# Altium schematic sheet mdv_commutator_v2.SchDoc
size 410 x 297 mm; DocumentNumber: 2; SheetNumber: 2; SheetTotal: 2; PageSetup: Record=PageOptions|CenterHorizontal=True|CenterVertical=True|PrintScale=1.00|XCorrection=1.00|YCorrection=1.00|PrintKind=1|BorderSize=5000000|LeftOffset=0|BottomOffset=0|Orientation=2|PaperLength=1000|PaperWidth=1000|Scale=100|PaperSource=15|PrintQuality=1200|MediaType=1|DitherType=10|PaperKind=A3|PrintScaleMode=1; Weight: -; ScaleFactor: -; NormInspection: Норм.Контр.
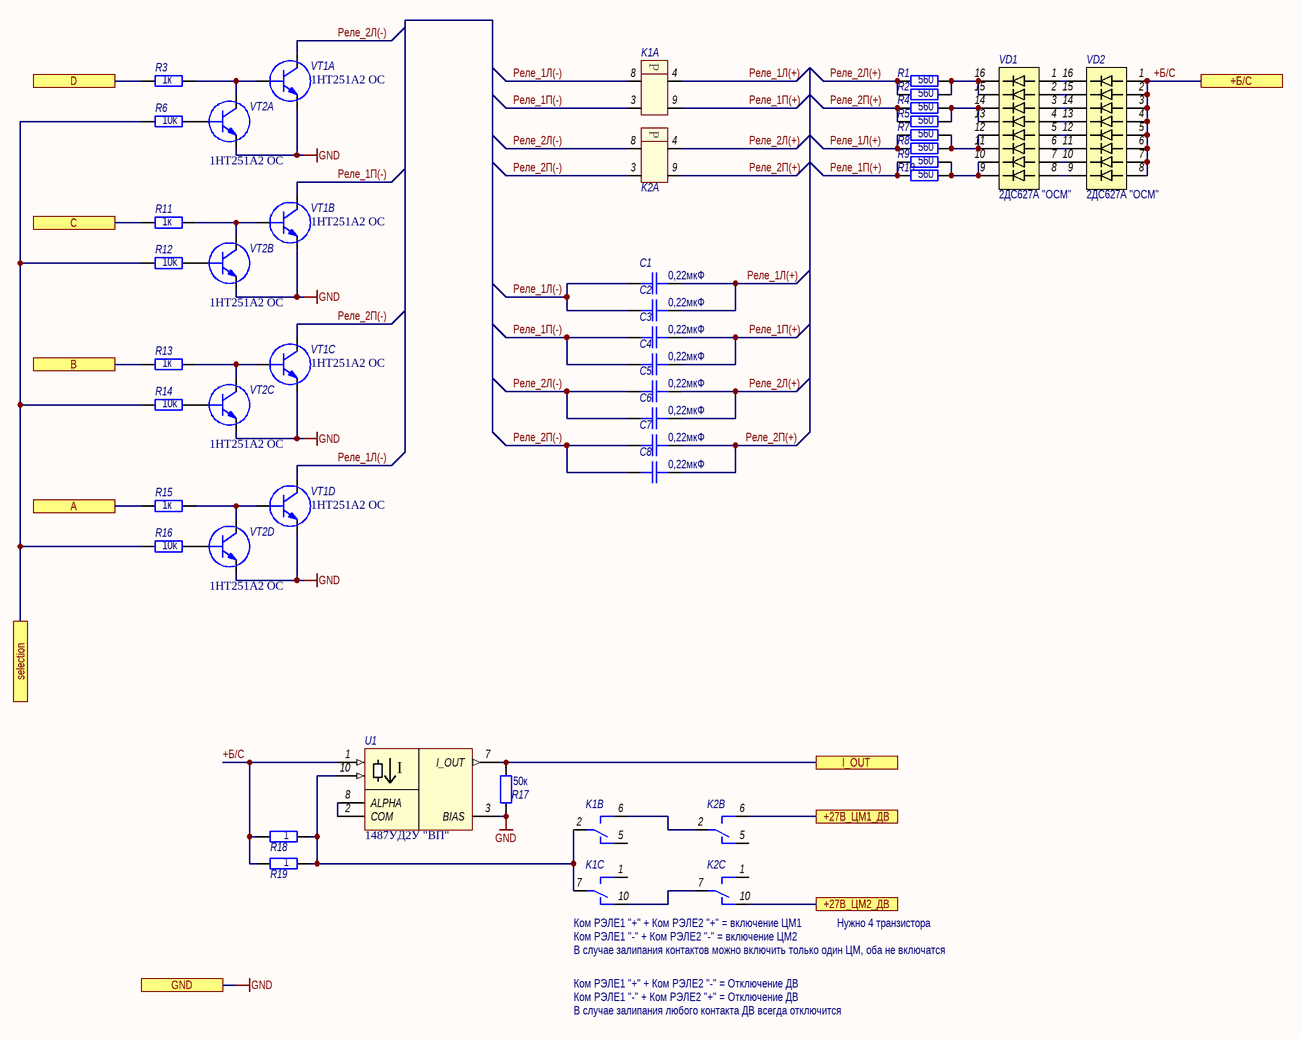
[diagram p0: mdv_commutator_v2.SchDoc]

## Parts
C1  value 0,22мкФ  [SMD_C0402]  (hidden comment: K10-79)
C2  value 0,22мкФ  [SMD_C0402]  (hidden comment: K10-79)
C3  value 0,22мкФ  [SMD_C0402]  (hidden comment: K10-79)
C4  value 0,22мкФ  [SMD_C0402]  (hidden comment: K10-79)
C5  value 0,22мкФ  [SMD_C0402]  (hidden comment: K10-79)
C6  value 0,22мкФ  [SMD_C0402]  (hidden comment: K10-79)
C7  value 0,22мкФ  [SMD_C0402]  (hidden comment: K10-79)
C8  value 0,22мкФ  [SMD_C0402]  (hidden comment: K10-79)
K1  RPS45-1-T-OS  [RPS-45-1]  (value not drawn)  (parts A,B,C of 3)
K2  RPS45-1-T-OS  [RPS-45-1]  (value not drawn)  (parts A,B,C of 3)
R1  value 560  [SMD_0805]  (hidden comment: OSM R1-12)
R2  value 560  [SMD_0805]  (hidden comment: OSM R1-12)
R3  value 1к  [SMD_0805]  (hidden comment: OSM R1-12)
R4  value 560  [SMD_0805]  (hidden comment: OSM R1-12)
R5  value 560  [SMD_0805]  (hidden comment: OSM R1-12)
R6  value 10k  [SMD_0805]  (hidden comment: OSM R1-12)
R7  value 560  [SMD_0805]  (hidden comment: OSM R1-12)
R8  value 560  [SMD_0805]  (hidden comment: OSM R1-12)
R9  value 560  [SMD_0805]  (hidden comment: OSM R1-12)
R10  value 560  [SMD_0805]  (hidden comment: OSM R1-12)
R11  value 1к  [SMD_0805]  (hidden comment: OSM R1-12)
R12  value 10k  [SMD_0805]  (hidden comment: OSM R1-12)
R13  value 1к  [SMD_0805]  (hidden comment: OSM R1-12)
R14  value 10k  [SMD_0805]  (hidden comment: OSM R1-12)
R15  value 1к  [SMD_0805]  (hidden comment: OSM R1-12)
R16  value 10k  [SMD_0805]  (hidden comment: OSM R1-12)
R17  value 50к  [SMD_0805]  (hidden comment: OSM R1-12)
R18  value 1  [SMD_0805]  (hidden comment: OSM R1-12)
R19  value 1  [SMD_0805]  (hidden comment: OSM R1-12)
U1  Наименование: 1487УД2У "ВП"  [FlatPack-10]  (hidden comment: 1487UD2U)
VD1  Наименование: 2ДС627А "ОСМ"  [401.16-3]  (hidden comment: 2DS627A OSM)
VD2  Наименование: 2ДС627А "ОСМ"  [401.16-3]  (hidden comment: 2DS627A OSM)
VT1  Наименование: 1НТ251А2 ОС  [FlatPack-14.PcbLib]  (hidden comment: 1NT251A2 OS)  (parts A,B,C,D of 4)
VT2  Наименование: 1НТ251А2 ОС  [FlatPack-14.PcbLib]  (hidden comment: 1NT251A2 OS)  (parts A,B,C,D of 4)

## Ports
+27В_ЦМ1_ДВ, +27В_ЦМ2_ДВ, +Б/С, A, B, C, D, GND, I_OUT, selection

## Nets
GND: R17.1 U1.3(BIAS) VT1.3(E) VT1.6(E) VT1.10(E) VT1.13(E) VT2.3(E) VT2.6(E) VT2.10(E) VT2.13(E) ; port GND
+27В_ЦМ1_ДВ: K2.6 ; port +27В_ЦМ1_ДВ
+27В_ЦМ2_ДВ: K2.10 ; port +27В_ЦМ2_ДВ
+Б/С: R18.2 R19.2 U1.1(V+) VD2.1(1A) VD2.2(1B) VD2.3(1C) VD2.4(1D) VD2.5(1E) VD2.6(1F) VD2.7(1G) VD2.8(1H) ; port +Б/С
A: R15.1 ; port A
B: R13.1 ; port B
C: R11.1 ; port C
D: R3.1 ; port D
I_OUT: R17.2 U1.7(I_OUT) ; port I_OUT
selection: R6.1 R12.1 R14.1 R16.1 ; port selection
Реле_1Л(+): C1.2 C2.2 K1.4 R7.1 R8.1
Реле_1Л(-): C1.1 C2.1 K1.8 VT1.7(C)
Реле_1П(+): C3.2 C4.2 K1.9 R9.1 R10.1
Реле_1П(-): C3.1 C4.1 K1.3 VT1.4(C)
Реле_2Л(+): C5.2 C6.2 K2.4 R1.1 R2.1
Реле_2Л(-): C5.1 C6.1 K2.8 VT1.14(C)
Реле_2П(+): C7.2 C8.2 K2.9 R4.1 R5.1
Реле_2П(-): C7.1 C8.1 K2.3 VT1.11(C)
NetK1_2: K1.2 K1.7 R18.1 R19.1 U1.10(V_SENSE)
NetK1_6: K1.6 K2.2
NetK1_10: K1.10 K2.7
NetR1_2: R1.2 R2.2 VD1.15(2B) VD1.16(2A)
NetR3_2: R3.2 VT1.2(B) VT2.14(C)
NetR4_2: R4.2 R5.2 VD1.13(2D) VD1.14(2C)
NetR6_2: R6.2 VT2.2(B)
NetR7_2: R7.2 R8.2 VD1.11(2F) VD1.12(2E)
NetR9_2: R9.2 R10.2 VD1.9(2G) VD1.10(2G)
NetR11_2: R11.2 VT1.12(B) VT2.4(C)
NetR12_2: R12.2 VT2.12(B)
NetR13_2: R13.2 VT1.5(B) VT2.11(C)
NetR14_2: R14.2 VT2.5(B)
NetR15_2: R15.2 VT1.9(B) VT2.7(C)
NetR16_2: R16.2 VT2.9(B)
NetU1_2: U1.2(COM) U1.8(ALPHA)
NetVD1_1: VD1.1(1A) VD2.16(2A)
NetVD1_2: VD1.2(1B) VD2.15(2B)
NetVD1_3: VD1.3(1C) VD2.14(2C)
NetVD1_4: VD1.4(1D) VD2.13(2D)
NetVD1_5: VD1.5(1E) VD2.12(2E)
NetVD1_6: VD1.6(1F) VD2.11(2F)
NetVD1_7: VD1.7(1G) VD2.10(2G)
NetVD1_8: VD1.8(1H) VD2.9(2G)

Not connected (* = marked no-connect by the designer): K1 1 5; K2 1 5

## Notes on the sheet
- Ком РЭЛЕ1 "+" + Ком РЭЛЕ2 "+" = включение ЦМ1
- Ком РЭЛЕ1 "-" + Ком РЭЛЕ2 "-" = включение ЦМ2
- Нужно 4 транзистора
- Ком РЭЛЕ1 "+" + Ком РЭЛЕ2 "-" = Отключение ДВ
- Ком РЭЛЕ1 "-" + Ком РЭЛЕ2 "+" = Отключение ДВ
- В случае залипания контактов можно включить только один ЦМ, оба не включатся
- В случае залипания любого контакта ДВ всегда отключится
- Подп. и дата
- Инв. № дубл.
- Взам. инв. №
- Инв. № подл.
- Изм.
- Лист
- № докум.
- Подп.
- Дата
- Форма 2а ГОСТ 2.104-2006
- Копировал
- Формат А3
- (in symbol AD8212S) I
- (in symbol RPS45, part A) P

## Library data of the parts
C1-C8 = Capacitor: Назначение: SMD-конденсатор; Наименование: К10-79; Потребление, Вт: 0; Напряжение: В; Точность: %
K1 K2 = RPS45: Реле поляризованное; Потребление, Вт: 0,000; Наименование: РПС45-1-Т-ОС РС4.520.756-11; Назначение: Реле поляризованное; ComponentLink1Description: DataSheet; ComponentLink1URL: https://relays.ru/files/catalog/rps45.pdf
R1-R19 = Resistor: Наименование: ОСМ Р1-12; Назначение: SMD-резистор; Потребление, Вт: 0,001; Точность: %
U1 = AD8212S: Назначение: Токовый датчик
VD1 VD2 = 2DS627A: Диодная матрица; Потребление, Вт: 0,0; Назначение: Диодная матрица; ComponentLink1Description: DataSheet; ComponentLink1URL: https://www.integral.by/sites/default/files/pdf/2ds627a.pdf
VT1 VT2 = 1NT251A2 OS: Транзисторная сборка; Назначение: Транзисторная сборка